# Altium schematic sheet Tead_Aliens_64A_CPU.SchDoc: Tead Aliens 64A CPU
size A4; Date: 23/01/2021; ApprovedBy: NeperMath; CheckedBy: NeperMath; Author: NeperMath; DrawnBy: NeperMath; Engineer: NeperMath; DocumentNumber: 1; Revision: 1; SheetNumber: 1; SheetTotal: 1; CurrentTime: 15:44; CurrentDate: 23/01/2021; Time: 15:44
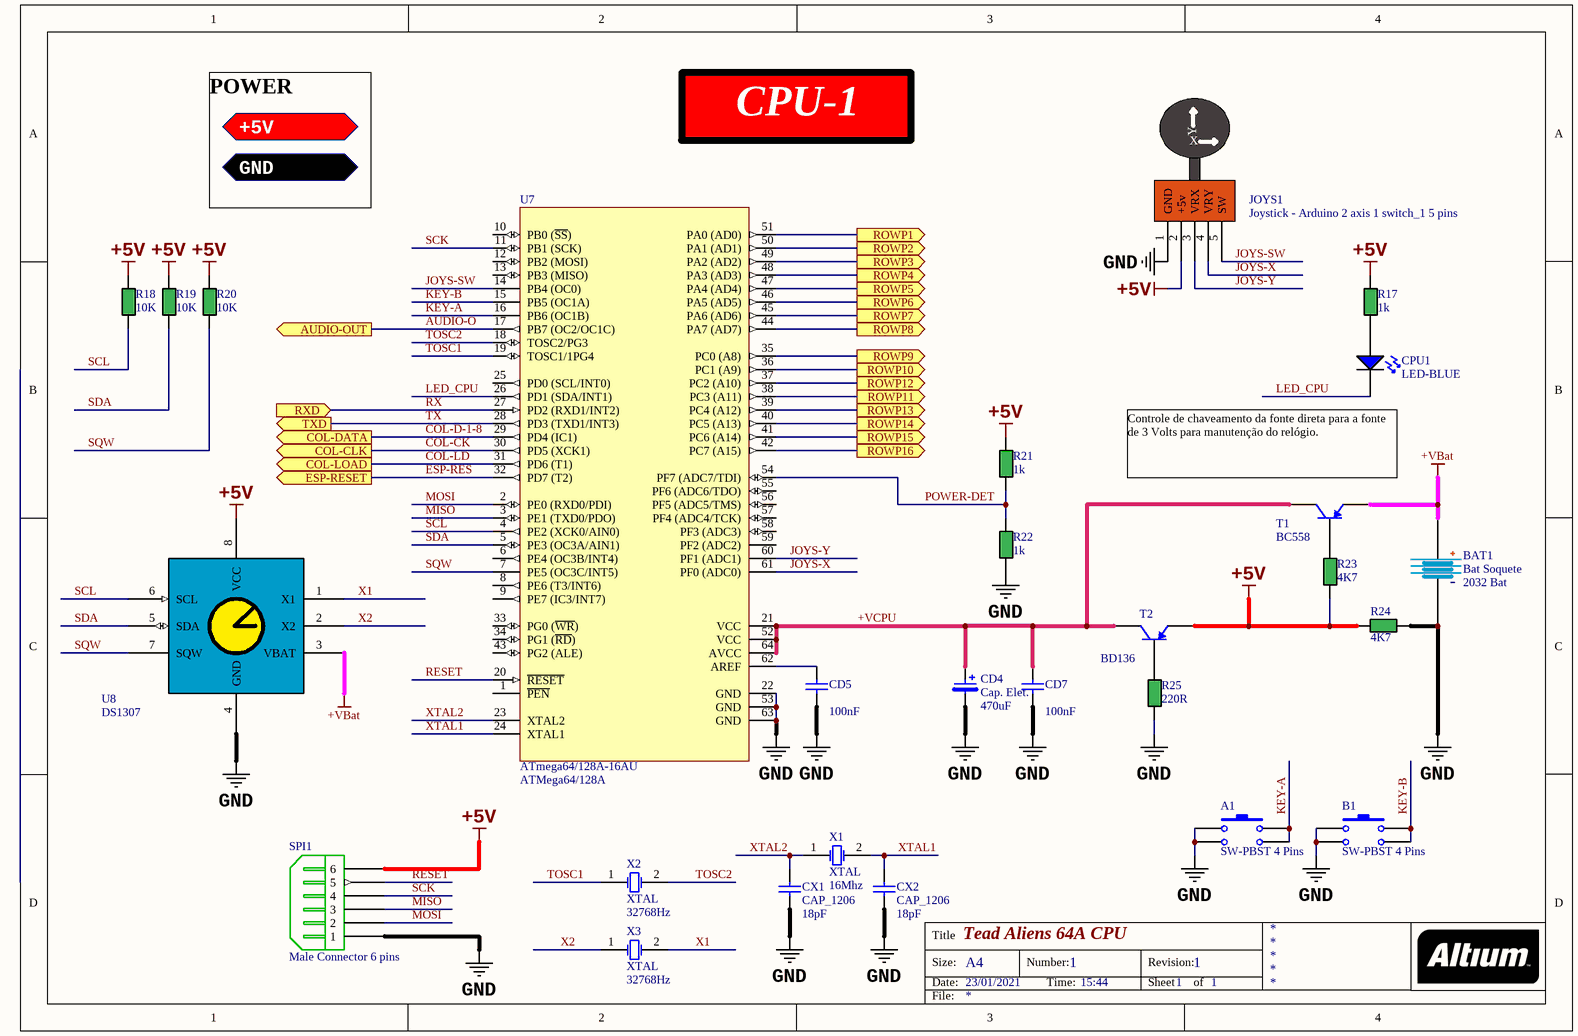
[diagram p0: Tead_Aliens_64A_CPU.SchDoc]

## Parts
A1  SW-PBST 4 Pins  [SW-PBST 4 PINS - B3F]
B1  SW-PBST 4 Pins  [SW-PBST 4 PINS - B3F]
BAT1  Bat Soquete  value 2032 Bat  [Batt Sup CR2025]
CD4  Cap. Elet.  value 470uF  [CAP ELE RAD 11mm H]
CD5  value 100nF  [CAP_1206]  (hidden comment: CAP_1206)
CD7  value 100nF  [CAP_1206]  (hidden comment: CAP_1206)
CPU1  LED-BLUE  [LED BLUE 3MM]
CX1  CAP_1206  value 18pF  [CAP_1206]
CX2  CAP_1206  value 18pF  [CAP_1206]
JOYS1  Joystick - Arduino 2 axis 1 switch_1 5 pins  [JOYSTICK ARDUINO 5 PINS 0 GRAUS]
R17  value 1k  [RES_0805]  (hidden comment: Resistor Generic)
R18  value 10K  [RES_0805]  (hidden comment: Resistor Generic)
R19  value 10K  [RES_0805]  (hidden comment: Resistor Generic)
R20  value 10K  [RES_0805]  (hidden comment: Resistor Generic)
R21  value 1k  [RES_0805]  (hidden comment: Resistor Generic)
R22  value 1k  [RES_0805]  (hidden comment: Resistor Generic)
R23  value 4K7  [RES_0805]  (hidden comment: Resistor Generic)
R24  value 4K7  [RES_0805]  (hidden comment: Resistor Generic)
R25  value 220R  [RES 300 CR25]  (hidden comment: Resistor Generic)
SPI1  Male Connector 6 pins  [BPSC-6]
T1  value BC558  [TO-92 - BIG]  (hidden comment: Transistor)
T2  value BD136  [TO126]  (hidden comment: Transistor)
U7  ATmega64/128A-16AU  value ATMega64/128A  [64A_L]
U8  DS1307  [DIP8]
X1  XTAL  value 16Mhz  [XTAL HC49-4H]
X2  XTAL  value 32768Hz  [XTAL CILINDRIC DEITADO]
X3  XTAL  value 32768Hz  [XTAL CILINDRIC DEITADO]

## Ports
+5V, AUDIO-OUT (out), COL-CLK (out), COL-DATA (out), COL-LOAD (out), ESP-RESET (out), GND, ROWP1 (out), ROWP2 (out), ROWP3 (out), ROWP4 (out), ROWP5 (out), ROWP6 (out), ROWP7 (out), ROWP8 (out), ROWP9 (out), ROWP10 (out), ROWP11 (out), ROWP12 (out), ROWP13 (out), ROWP14 (out), ROWP15 (out), ROWP16 (out), RXD (in), TXD (out)

## Nets
+5V: JOYS1.2(+5v) R17.2 R18.2 R19.2 R20.2 R21.2 R23.1 R24.2 SPI1.6 T2.1(E) U8.8(VCC)
+VBat: BAT1.1 T1.1(E) U8.3(VBAT)
GND: A1.1 A1.2 B1.1 B1.2 BAT1.2 CD4.2 CD5.1 CD7.1 CX1.1 CX2.1 JOYS1.1(GND) R22.1 R24.1 R25.1 SPI1.1 U7.22(GND) U7.53(GND) U7.63(GND) U8.4(GND)
+VCPU: CD4.1 CD7.2 T1.3(C) T2.3(C) U7.21(VCC) U7.52(VCC) U7.64(AVCC)
AUDIO-O: U7.17(PB7_(OC2/OC1C)) ; port AUDIO-OUT
COL-CK: U7.30(PD5_(XCK1)) ; port COL-CLK
COL-D-1-8: U7.29(PD4_(IC1)) ; port COL-DATA
COL-LD: U7.31(PD6_(T1)) ; port COL-LOAD
ESP-RES: U7.32(PD7_(T2)) ; port ESP-RESET
JOYS-SW: JOYS1.5(SW) U7.14(PB4_(OC0))
JOYS-X: JOYS1.4(VRY) U7.61(PF0_(ADC0))
JOYS-Y: JOYS1.3(VRX) U7.60(PF1_(ADC1))
KEY-A: A1.3 A1.4 U7.16(PB6_(OC1B))
KEY-B: B1.3 B1.4 U7.15(PB5_(OC1A))
LED_CPU: CPU1.K U7.26(PD1_(SDA/INT1))
MISO: SPI1.3 U7.3(PE1_(TXD0/PDO))
MOSI: SPI1.2 U7.2(PE0_(RXD0/PDI))
POWER-DET: R21.1 R22.2 U7.54(PF7_(ADC7/TDI))
RESET: SPI1.5 U7.20(~{RESET})
ROWP1: U7.51(PA0_(AD0)) ; port ROWP1
ROWP2: U7.50(PA1_(AD1)) ; port ROWP2
ROWP3: U7.49(PA2_(AD2)) ; port ROWP3
ROWP4: U7.48(PA3_(AD3)) ; port ROWP4
ROWP5: U7.47(PA4_(AD4)) ; port ROWP5
ROWP6: U7.46(PA5_(AD5)) ; port ROWP6
ROWP7: U7.45(PA6_(AD6)) ; port ROWP7
ROWP8: U7.44(PA7_(AD7)) ; port ROWP8
ROWP9: U7.35(PC0_(A8)) ; port ROWP9
ROWP10: U7.36(PC1_(A9)) ; port ROWP10
ROWP11: U7.38(PC3_(A11)) ; port ROWP11
ROWP12: U7.37(PC2_(A10)) ; port ROWP12
ROWP13: U7.39(PC4_(A12)) ; port ROWP13
ROWP14: U7.40(PC5_(A13)) ; port ROWP14
ROWP15: U7.41(PC6_(A14)) ; port ROWP15
ROWP16: U7.42(PC7_(A15)) ; port ROWP16
RX: U7.27(PD2_(RXD1/INT2)) ; port RXD
SCK: SPI1.4 U7.11(PB1_(SCK))
SCL: R18.1 U7.4(PE2_(XCK0/AIN0)) U8.6(SCL)
SDA: R19.1 U7.5(PE3_(OC3A/AIN1)) U8.5(SDA)
SQW: R20.1 U7.7(PE5_(OC3C/INT5)) U8.7(SQW)
TOSC1: U7.19(TOSC1/1PG4) X2.1(OSC1)
TOSC2: U7.18(TOSC2/PG3) X2.2(OSC2)
TX: U7.28(PD3_(TXD1/INT3)) ; port TXD
X1: U8.1(X1) X3.2(OSC2)
X2: U8.2(X2) X3.1(OSC1)
XTAL1: CX2.2 U7.24(XTAL1) X1.2(OSC2)
XTAL2: CX1.2 U7.23(XTAL2) X1.1(OSC1)
NetCD5_2: CD5.2 U7.62(AREF)
NetCPU1_A: CPU1.A R17.1
NetR23_2: R23.2 T1.2(B)
NetR25_2: R25.2 T2.2(B)

Not connected (* = marked no-connect by the designer): U7 1(~{PEN}) 6(PE4_(OC3B/INT4)) 8(PE6_(T3/INT6)) 9(PE7_(IC3/INT7)) 10(PB0_(~{SS})) 12(PB2_(MOSI)) 13(PB3_(MISO)) 25(PD0_(SCL/INT0)) 33(PG0_(~{WR})) 34(PG1_(~{RD})) 43(PG2_(ALE)) 55(PF6_(ADC6/TDO)) 56(PF5_(ADC5/TMS)) 57(PF4_(ADC4/TCK)) 58(PF3_(ADC3)) 59(PF2_(ADC2))

## Notes on the sheet
- CPU-1
- POWER
- Controle de chaveamento da fonte direta para a fonte de 3 Volts para manutenção do relógio.
- Title
- Size:
- Date:
- A4
- Number:
- Time:
- Revision:
- Sheet
- of
- File:
- (in symbol Joystick - Arduino 2 axis 1 switch_1 5 pins) Y; X

## Library data of the parts
A1 B1 = SW-PBST 4 Pins SKHH: Published: 24-Mar-1999; LatestRevisionDate: 17-Jul-2002; LatestRevisionNote: Re-released for DXP Platform.; PackageReference: SPST-2; Publisher: Altium Limited
BAT1 = Bat 3.6v
CD4 = CAP_RADIAL_ELETROLITICO: Capacitor Radial Eletrolitico
CD5 CD7 CX1 CX2 = CAP_1206: SMD Capacitor 1206 size
CPU1 = LED-BLUE: LED BLUE
JOYS1 = Joystick - Arduino 2 axis 1 switch_1 5 pins: Arduino Joystick 2 axis 1 switch 5 pins
R17-R25 = Resistor Generic: Generic Resistor
SPI1 = Male Con 6 Pin
T1 T2 = T-PNP: General Bipolar Transistor NPN
U7 = ATmega128A-16AU: 8-Bit AVR Microcontroller with 128K Bytes of In-System Programmable Flash Memory; Published: 17-Sep-2003; LatestRevisionDate: 13-Apr-2006; LatestRevisionNote: IPC-7351 Footprint Added.; DatasheetVersion: 2467G-AVR-09/02; PackageVersion: revB, Oct-2001; PackageReference: 64A; Publisher: Altium Limited; PackageDescription: 64-Pin Thin Quad Flat Pack 0.8 mm Pitch; Code_JEDEC: MS-026-AEB; ComponentLink1Description: Manufacturer Link; ComponentLink1URL: http://www.atmel.com; ComponentLink2Description: Datasheet; ComponentLink2URL: http://www.atmel.com/dyn/resources/prod_documents/doc2467.pdf
U8 = RTC: Real Time Clock
X1-X3 = XTAL: Crystal Oscillator